# EasyEDA Pro project ProPrj_FPC屏幕排线及测试板.epro

# Schematic Schematic2_2
Board Name: MIPI转接板（含iic）; Create Date: 2025-09-10; Page Name: MIPI; Project Name: 3寸屏幕转接板; Schematic Name: Schematic2_2; Update Date: 2025-09-10; Company: 嘉立创EDA; Page Size: A4; Version: V1.0
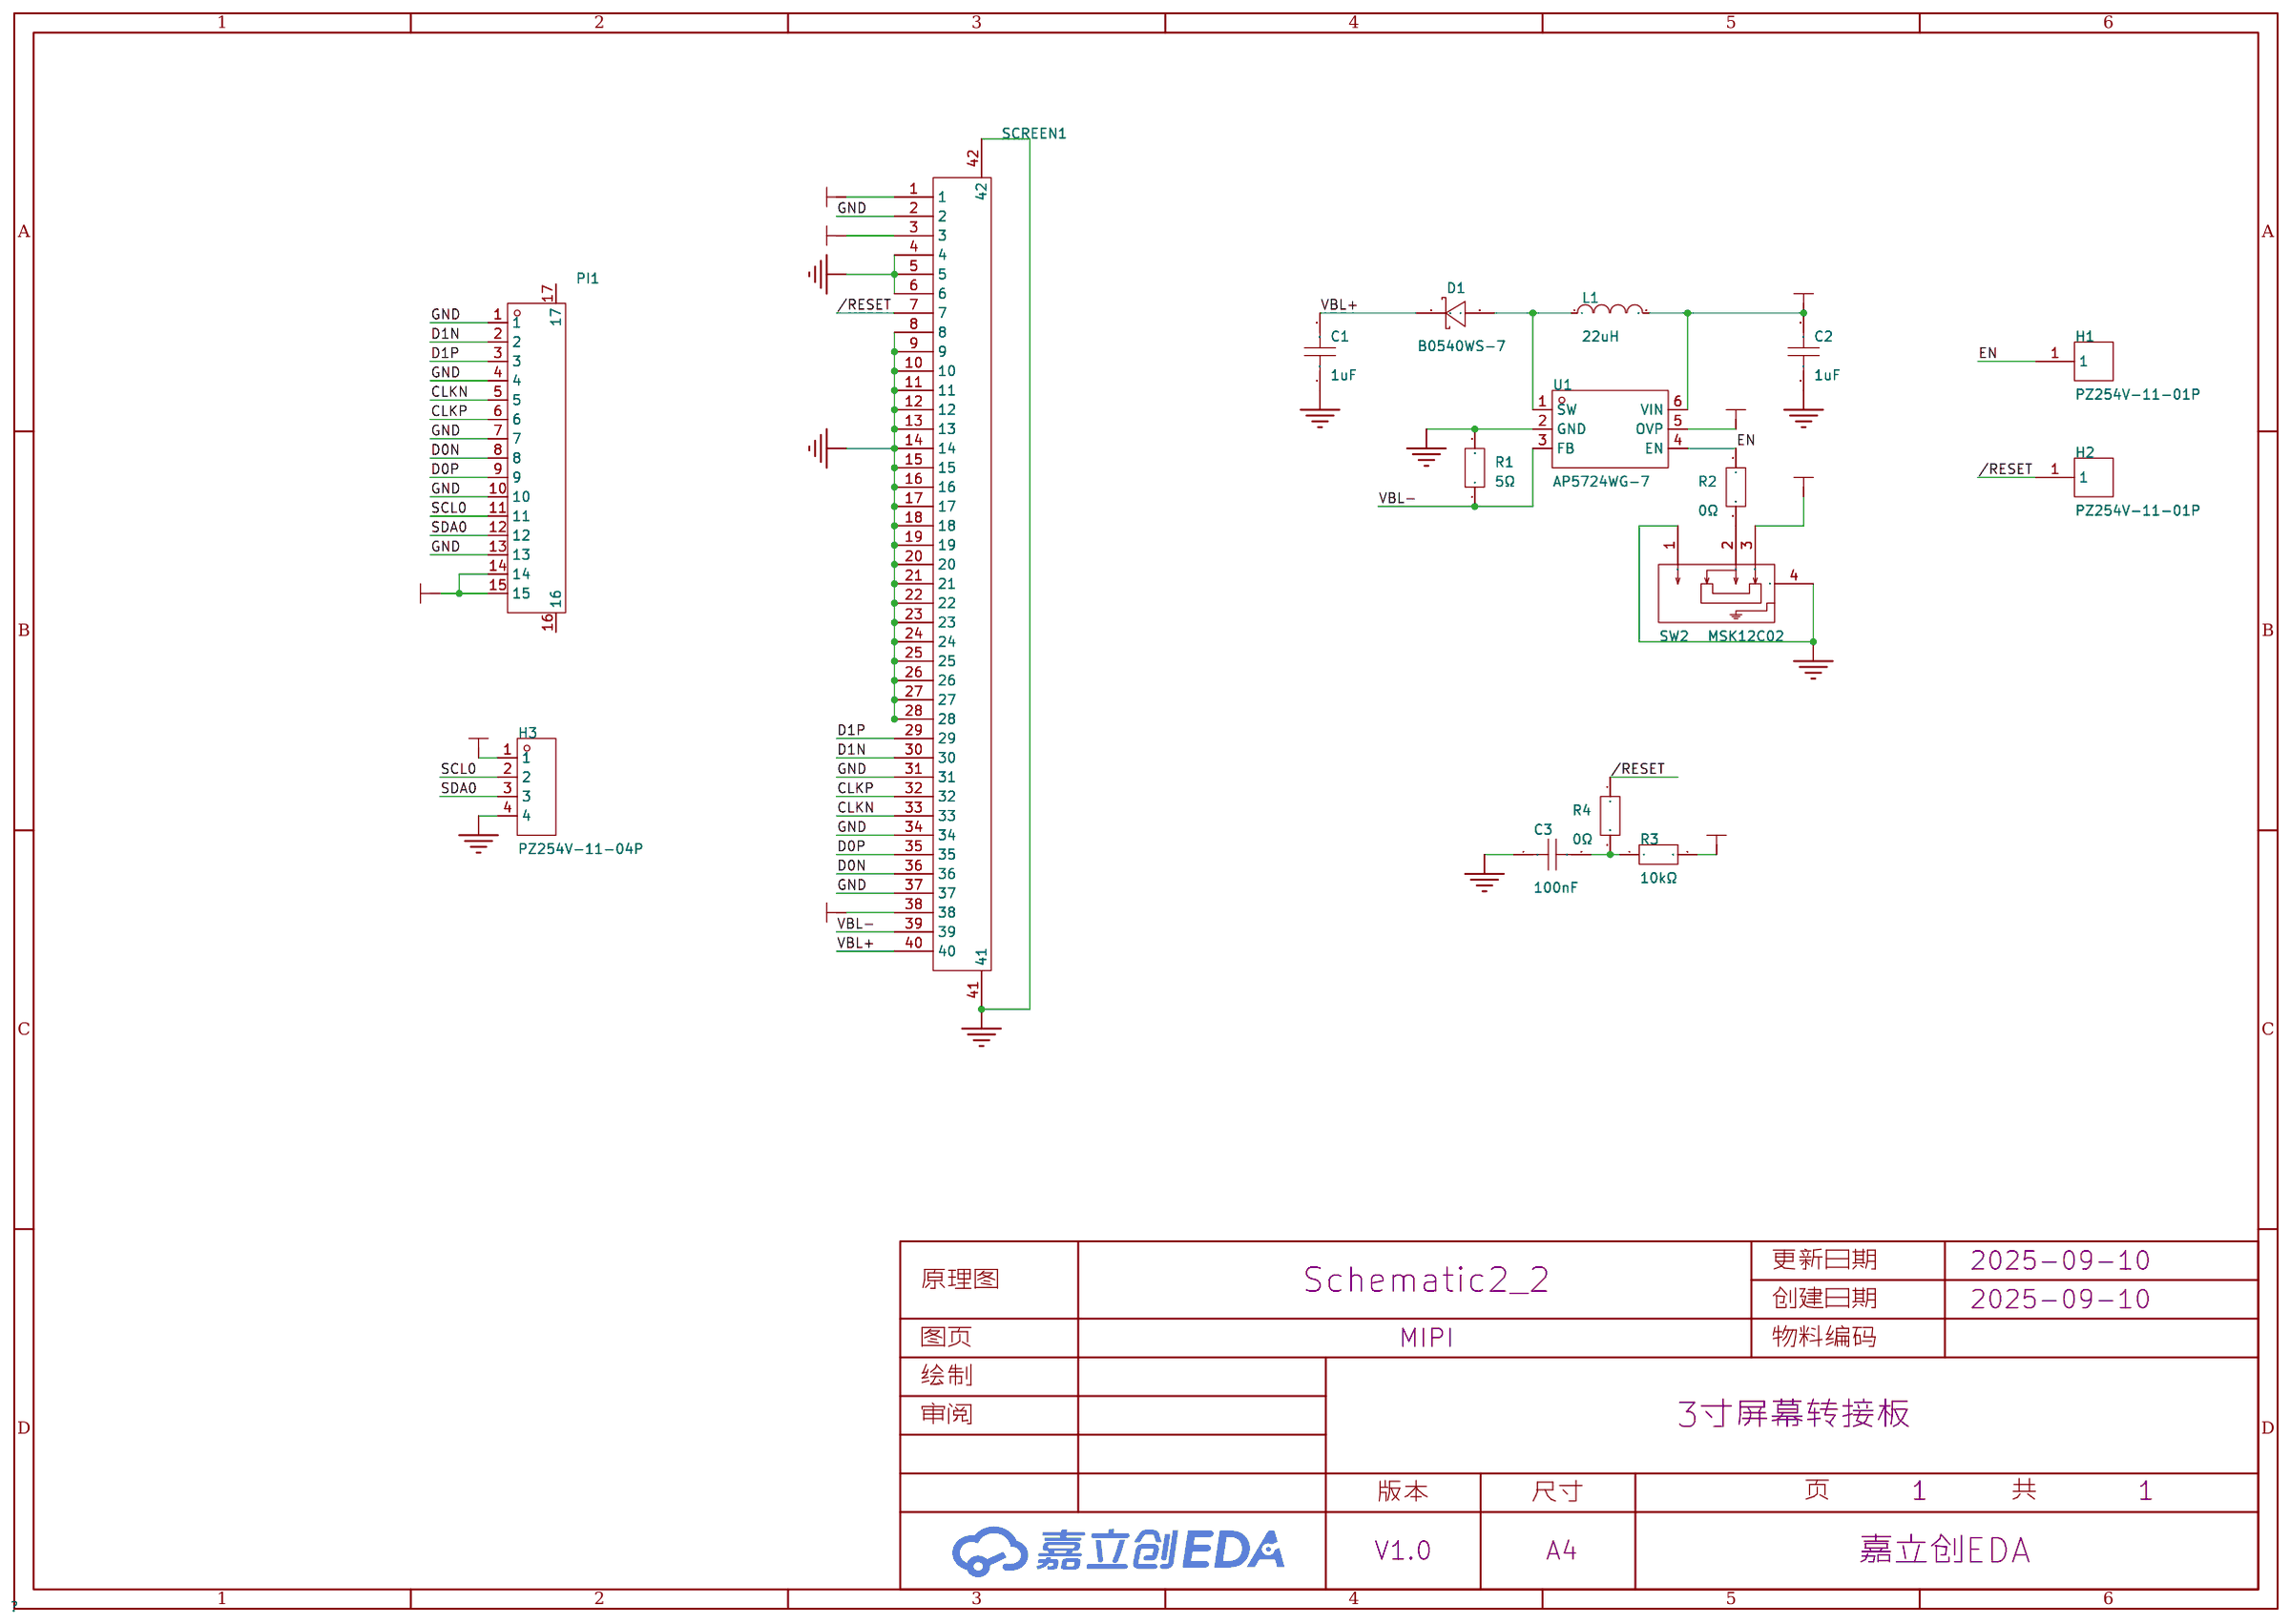
[diagram p0: schematic sheet]

## Parts
C1  1uF  [C0603]
C2  1uF  [C0603]
C3  100nF  [C0603]
D1  B0540WS-7  [SOD-323_L1.8-W1.3-LS2.5-RD]
H1  PZ254V-11-01P  [HDR-TH_1P-P2.54-V-M]
H2  PZ254V-11-01P  [HDR-TH_1P-P2.54-V-M]
H3  PZ254V-11-04P  [HDR-TH_4P-P2.54-V-M]
L1  22uH  [IND-SMD_L4.0-W4.0]
PI1  FPC-1.0FX-15PWCR-H20  [FPC-SMD_15P-P1.00_XUNPU_FPC-1.0FX-15PWCR-H20]
R1  5Ω  [R0603]
R2  0Ω  [R0603]
R3  10kΩ  [R0603]
R4  0Ω  [R0603]
SCREEN1  AFC01-S40FCA-00  [FPC-SMD_P0.50-40P_FGS-XJ-H2.0]
SW2  MSK12C02  [SW-TH_MSK12C02]
U1  AP5724WG-7  [SOT-23-6_L2.9-W1.6-P0.95-LS2.8-BL]

## Library data of the parts
C1-C3 = CC0603KRX7R9BB105: 容值:1uF;精度:±10%;额定电压:50V;材质(温度系数):X7R;; LCSC Part Name: 1uF ±10% 50V; Supplier Part: C559769; Manufacturer: YAGEO(国巨); Supplier Footprint: 0603; JLCPCB Part Class: 扩展库; Datasheet: https://atta.szlcsc.com/upload/public/pdf/source/20181031/C325451_C7CF01155AE3010E0D610C52F5FE7D31.pdf; Supplier: LCSC; Tolerance: ±10%; Voltage Rated: 50V; Temperature Coefficient: X7R
D1 = B0540WS-7: 正向压降(Vf):550mV@500mA;直流反向耐压(Vr):40V;整流电流:500mA;; LCSC Part Name: 电压:40V 电流:500mA; Supplier Part: C98664; Manufacturer: DIODES(美台); Supplier Footprint: SOD-323; JLCPCB Part Class: 扩展库; Datasheet: https://atta.szlcsc.com/upload/public/pdf/source/20171221/C98664_15138313338551195621.pdf; Supplier: LCSC; Forward Voltage (Vf@If): 550mV@500mA; Reverse Voltage (Vr): 40V; Rectified Current: 500mA; Reverse Leakage Current (Ir): 5uA@30V
H1 H2 = PZ254V-11-01P: 插针结构:1x1P;间距:2.54mm;行距:-;圆针/方针:方针;安装方式:直插;排数:单排;总PIN位数:1P;额定电流:-;额定电压:-;配合针长度:6mm;塑高:2.5mm;端接针长度:3mm;触头材质:黄铜;触头镀层:-;工作温度:-40℃~+105℃;颜色:黑色;; LCSC Part Name: 1x1P 间距:2.54mm 方针 直插; Supplier Part: C492400; Manufacturer: XFCN(兴飞); Supplier Footprint: 插件,P=2.54mm; JLCPCB Part Class: 扩展库; Datasheet: https://atta.szlcsc.com/upload/public/pdf/source/20200309/C492400_46876A5B545F5AE6B8D4A09C46E276E8.pdf; Supplier: LCSC; Pin Structure: 1x1P; Pitch: 2.54mm; Circluar Pins/Square Pins: 方针; Mounting Type: 直插; Number of Rows: 单排; Number of Pins: 1P; Length of Mating Pin: 6mm; Insulation Height: 2.5mm; Length of End Connection Pin: 3mm; Contact Material: 黄铜; Operating Temperature: -40℃~+105℃; Color: 黑色
H3 = PZ254V-11-04P: 插针结构:1x4P;间距:2.54mm;行距:-;圆针/方针:方针;安装类型:直插;排数:单排;总PIN位数:4P;额定电流:3A;额定电压:250V;配合针长度:6mm;塑高:2.5mm;端接针长度:3mm;触头材质:-;工作温度范围:-40℃~+105℃;颜色:黑色;; LCSC Part Name: 间距:2.54mm 1x4P 直插 方针; Supplier Part: C2691448; Manufacturer: XFCN(兴飞); Supplier Footprint: 插件,P=2.54mm; JLCPCB Part Class: 扩展库; Datasheet: https://atta.szlcsc.com/upload/public/pdf/source/20200309/C492403_F9F19131791D08044AD4F84F8E751A34.pdf; Supplier: LCSC; Pin Structure: 1x4P; Pitch: 2.54mm; Circluar Pins/Square Pins: 方针; Mounting Type: 直插; Number of Rows: 单排; Number of Pins: 4P; Current Rating (Max): 3A; Voltage Rating (Max): 250V; Length of Mating Pin: 6mm; Insulation Height: 2.5mm; Length of End Connection Pin: 3mm; Operating Temperature Range: -40℃~+105℃; Color: 黑色
L1 = SLS3D16S220MTT: 电感值:22uH;精度:±20%;额定电流:310mA;; LCSC Part Name: 22uH ±20%; Supplier Part: C364105; Manufacturer: Sunltech(顺磁); Supplier Footprint: SMD,4x4mm; JLCPCB Part Class: 扩展库; Datasheet: https://atta.szlcsc.com/upload/public/pdf/source/20190129/C364139_5B32995B150CB1C3097D10AB7A086957.pdf; Supplier: LCSC; Tolerance: ±20%; Current Rating: 310mA; DC Resistance(DCR): 356mΩ
PI1 = FPC-1.0FX-15PWCR-H20: 锁定特性:翻盖式;触点类型:下接;触点数量:15P;间距:1mm;安装类型:卧贴;; LCSC Part Name: 间距:1mm P数:15P 翻盖式 下接; Supplier Part: C19269358; Manufacturer: XUNPU(讯普); Supplier Footprint: SMD,P=1mm,卧贴; JLCPCB Part Class: 扩展库; Datasheet: https://atta.szlcsc.com/upload/public/pdf/source/20231121/46D1D420E162B395A0FFF09C3BB98E72.pdf; Supplier: LCSC; Locking Feature: 翻盖式; Contact Type: 下接; Number of Contacts: 15P; Pitch: 1mm; Mounting Type: 卧贴; Height Above Board: 2mm
R1-R4 = CSRT0603FT5R00: 电阻类型:薄膜电阻;阻值:5Ω;精度:±1%;功率:400mW;温度系数:±50ppm/℃;; LCSC Part Name: 薄膜电阻 5Ω ±1% 400mW; Supplier Part: C6145550; Manufacturer: SEI(Stackpole Electronics Inc.); Supplier Footprint: 0603; JLCPCB Part Class: 扩展库; Datasheet: https://atta.szlcsc.com/upload/public/pdf/source/231023/sei-csrt.pdf-64f9fffa9e691e2aa43dba71297e1c22.pdf; Supplier: LCSC; Type: 薄膜电阻; Tolerance: ±1%; Power(Watts): 400mW; Temperature Coefficient: ±50ppm/℃; Operating Temperature Range: -55℃~+155℃
SCREEN1 = AFC01-S40FCA-00: 锁定特性:翻盖式;触点类型:下接;触点数量:40P;间距:0.5mm;安装类型:卧贴;; LCSC Part Name: 间距:0.5mm P数:40P 翻盖式 下接; Supplier Part: C262674; Manufacturer: JS(钜硕电子); Supplier Footprint: SMD,P=0.5mm,卧贴; JLCPCB Part Class: 扩展库; Datasheet: https://atta.szlcsc.com/upload/public/pdf/source/20190816/C413942_2A72D1AC756EAE17EEDF756A339D4500.pdf; Supplier: LCSC; Locking Feature: 翻盖式; Contact Type: 下接; Number of Contacts: 40P; Pitch: 0.5mm; Mounting Type: 卧贴; FFC, FCB Thickness: 0.3mm; Height Above Board: 2mm
SW2 = MSK12C02: 电路结构:单刀双掷;安装方式:卧贴;开关颜色:-;额定电流(DC):50mA;额定电压(DC):12V;额定电流(AC):-;额定电压(AC):-;机械寿命:1万次;; LCSC Part Name: 两档侧拨贴片 7脚 滑动开关; Supplier Part: C431540; Manufacturer: SHOU HAN(首韩); Supplier Footprint: SMD; JLCPCB Part Class: 扩展库; Datasheet: https://atta.szlcsc.com/upload/public/pdf/source/20190925/C431540_89155AEF0758B9AD1B2D805F83FB12E3.pdf; Supplier: LCSC; Circuit: 单刀双掷; Pin Style: SMD接片; Switch Length: 8mm; Switch Width: 2.8mm; Switch Height: 1.4mm; Mounting Style: 卧贴; Current Rating (DC): 50mA; Voltage Rating (DC): 12V; Mechanical Life: 1万次; Operating Temperature: -20℃~+70℃
U1 = AP5724WG-7: 类型:DC-DC稳压器;工作电压:2.7V~5.5V;开关频率:1.2MHz;通道数:1;输出电压:-;输出电流:750mA;调光:PWM;拓扑结构:升压;; LCSC Part Name: 输出750mA 升压型驱动; Supplier Part: C154870; Manufacturer: DIODES(美台); Supplier Footprint: SOT-26; JLCPCB Part Class: 扩展库; Datasheet: https://atta.szlcsc.com/upload/public/pdf/source/20171221/C154870_15138395483881195892.pdf; Supplier: LCSC; Type: DC-DC稳压器; Voltage - Input: 2.7V~5.5V; Frequency - Switching: 1.2MHz; Number of Channels: 1; Output Current: 750mA; Dimming: PWM; Topology: 升压; Operating temperature: -40℃~+85℃

## Nets
3.3V: C2.2 H3.1 L1.2 PI1.14 PI1.15 R3.2 SCREEN1.1 SCREEN1.3 SCREEN1.38 SW2.3 U1.6(VIN)
GND: C1.1 C2.1 C3.1 H3.4 PI1.1 PI1.4 PI1.7 PI1.10 PI1.13 R1.2 SCREEN1.2 SCREEN1.4 SCREEN1.5 SCREEN1.6 SCREEN1.8 SCREEN1.9 SCREEN1.10 SCREEN1.11 SCREEN1.12 SCREEN1.13 SCREEN1.14 SCREEN1.15 SCREEN1.16 SCREEN1.17 SCREEN1.18 SCREEN1.19 SCREEN1.20 SCREEN1.21 SCREEN1.22 SCREEN1.23 SCREEN1.24 SCREEN1.25 SCREEN1.26 SCREEN1.27 SCREEN1.28 SCREEN1.31 SCREEN1.34 SCREEN1.37 SCREEN1.41 SCREEN1.42 SW2.1 SW2.4 U1.2(GND)
/RESET: H2.1 R4.1 SCREEN1.7
CLKN: PI1.5 SCREEN1.33
CLKP: PI1.6 SCREEN1.32
D0N: PI1.8 SCREEN1.36
D0P: PI1.9 SCREEN1.35
D1N: PI1.2 SCREEN1.30
D1P: PI1.3 SCREEN1.29
EN: H1.1 R2.1 U1.4(EN)
SCL0: H3.2 PI1.11
SDA0: H3.3 PI1.12
VBL+: C1.2 D1.1(C) SCREEN1.40 U1.5(OVP)
VBL-: R1.1 SCREEN1.39 U1.3(FB)
$1N1782: D1.2(A) L1.1 U1.1(SW)
$1N2676: R2.2 SW2.2
$1N2940: C3.2 R3.1 R4.2

Not connected (* = marked no-connect by the designer): PI1 16 17

# Schematic Schematic3
Board Name: 【复刻】FPC软排线; Create Date: 2025-09-10; Page Name: P1; Project Name: 3寸屏幕转接板; Schematic Name: Schematic3; Update Date: 2025-09-10; Company: 嘉立创EDA; Page Size: A4; Version: V1.0
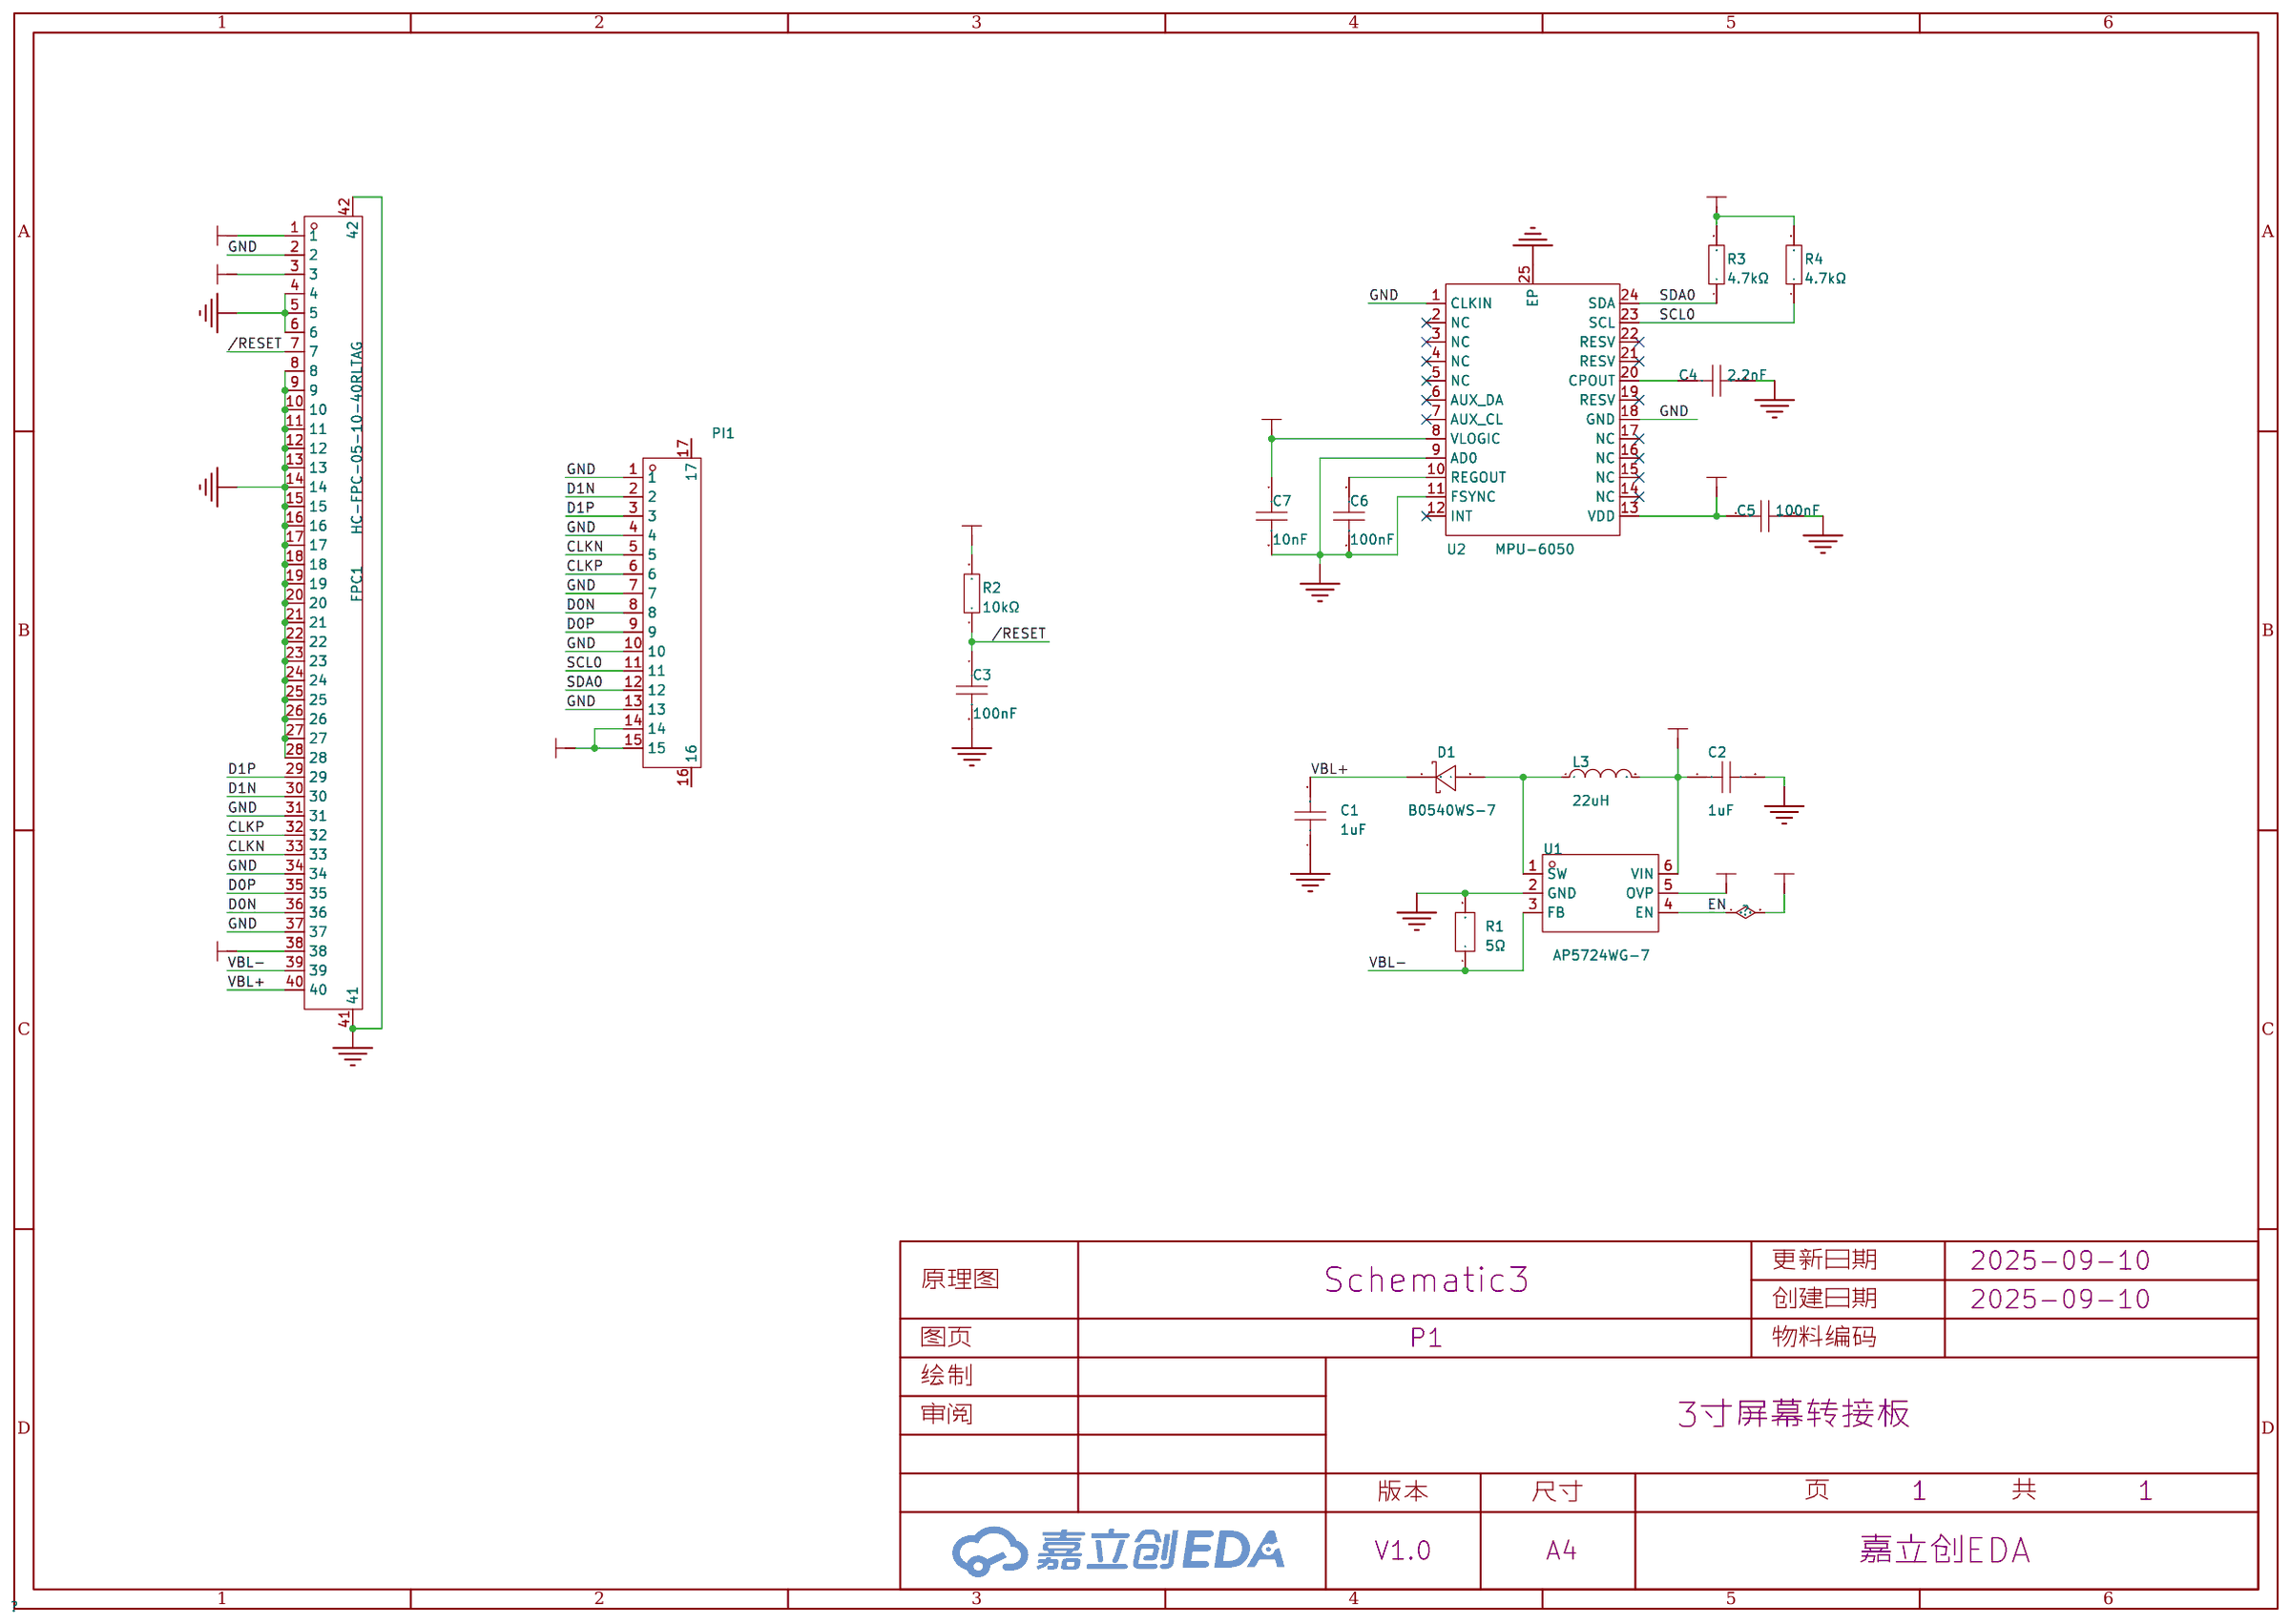
[diagram p1: schematic sheet]

## Parts
C1  1uF  [C0402]
C2  1uF  [C0402]
C3  100nF  [C0402]
C4  2.2nF  [C0603]
C5  100nF  [C0402]
C6  100nF  [C0402]
C7  10nF  [C0402]
D1  B0540WS-7  [SOD-323_L1.8-W1.3-LS2.5-RD]
FPC1  HC-FPC-05-10-40RLTAG  [FPC-SMD_40P-P0.50_HCTL_HC-FPC-05-10-40RLTAG]
L3  22uH  [IND-SMD_L2.5-W2.0_MHCHL2520]
PI1  FPC-1.0FX-15PWCR-H20  [FPC-SMD_15P-P1.00_XUNPU_FPC-1.0FX-15PWCR-H20]
R1  5Ω  [R0603]
R2  10kΩ  [R0402]
R3  4.7kΩ  [R0402]
R4  4.7kΩ  [R0402]
U1  AP5724WG-7  [SOT-23-6_L2.9-W1.6-P0.95-LS2.8-BL]
U2  MPU-6050  [QFN-24_L4.0-W4.0-P0.50-BL-EP2.7]

## Library data of the parts
C1 C2 = CL05A105KA5NQNC: 容值:1uF;精度:±10%;额定电压:25V;温度系数:X5R;; LCSC Part Name: 1uF ±10% 25V; Supplier Part: C52923; Manufacturer: SAMSUNG(三星); Supplier Footprint: 0402; JLCPCB Part Class: 基础库; Datasheet: https://item.szlcsc.com/datasheet/CL05A105KA5NQNC/53938.html; Supplier: LCSC; Tolerance: ±10%; Voltage Rating: 25V; Temperature Coefficient: X5R
C3 C5-C7 = GRM1555C1H222GA01D: 容值:2.2nF;精度:±2%;额定电压:50V;温度系数:C0G;; LCSC Part Name: 2.2nF ±2% 50V; Supplier Part: C2987940; Manufacturer: muRata(村田); Supplier Footprint: 0402; JLCPCB Part Class: 扩展库; Datasheet: https://item.szlcsc.com/datasheet/GRM1555C1H222GA01D/3443038.html; Supplier: LCSC; Tolerance: ±2%; Voltage Rating: 50V; Temperature Coefficient: C0G
C4 = CC0603KRX7R9BB105: 容值:1uF;精度:±10%;额定电压:50V;材质(温度系数):X7R;; LCSC Part Name: 1uF ±10% 50V; Supplier Part: C559769; Manufacturer: YAGEO(国巨); Supplier Footprint: 0603; JLCPCB Part Class: 扩展库; Datasheet: https://atta.szlcsc.com/upload/public/pdf/source/20181031/C325451_C7CF01155AE3010E0D610C52F5FE7D31.pdf; Supplier: LCSC; Tolerance: ±10%; Voltage Rated: 50V; Temperature Coefficient: X7R
D1 = B0540WS-7: 正向压降(Vf):550mV@500mA;直流反向耐压(Vr):40V;整流电流:500mA;; LCSC Part Name: 电压:40V 电流:500mA; Supplier Part: C98664; Manufacturer: DIODES(美台); Supplier Footprint: SOD-323; JLCPCB Part Class: 扩展库; Datasheet: https://atta.szlcsc.com/upload/public/pdf/source/20171221/C98664_15138313338551195621.pdf; Supplier: LCSC; Forward Voltage (Vf@If): 550mV@500mA; Reverse Voltage (Vr): 40V; Rectified Current: 500mA; Reverse Leakage Current (Ir): 5uA@30V
FPC1 = HC-FPC-05-10-40RLTAG: 锁定特性:翻盖式;触点类型:下接;触点数量:40P;间距:0.5mm;安装类型:卧贴;工作温度范围:-55℃~+85℃;; LCSC Part Name: 翻盖式 下接 P数:40P 间距:0.5mm; Supplier Part: C5213744; Manufacturer: HCTL(华灿天禄); Supplier Footprint: SMD,P=0.5mm,卧贴; JLCPCB Part Class: 扩展库; Datasheet: https://atta.szlcsc.com/upload/public/pdf/source/20221027/B2DE489DA152049D1F105170189CFB4E.pdf; Supplier: LCSC; Locking Feature: 翻盖式; Contact Type: 下接; Number of Contacts: 40P; Pitch: 0.5mm; Mounting Type: 卧贴; FFC, FCB Thickness: 0.3mm; Height Above Board: 1mm; Contact Material: 铜合金; Operating Temperature Range: -55℃~+85℃
L3 = FTC252010S220MBCA: 电感值:22uH;精度:±20%;额定电流:850mA;饱和电流(Isat):1.1A;类型:一体成型电感;; LCSC Part Name: 22uH ±20% 1.1A; Supplier Part: C5832391; Manufacturer: cjiang(长江微电); Supplier Footprint: SMD,2x2.5mm; JLCPCB Part Class: 扩展库; Datasheet: https://atta.szlcsc.com/upload/public/pdf/source/20230602/8FFEDA9C0247A92A0D4B67554BFE4091.pdf; Supplier: LCSC; Tolerance: ±20%; Rated Current: 850mA; Saturation Current (Isat): 1.1A; DC Resistance (DCR): 1.1Ω; Type: 一体成型电感
PI1 = FPC-1.0FX-15PWCR-H20: 锁定特性:翻盖式;触点类型:下接;触点数量:15P;间距:1mm;安装类型:卧贴;; LCSC Part Name: 间距:1mm P数:15P 翻盖式 下接; Supplier Part: C19269358; Manufacturer: XUNPU(讯普); Supplier Footprint: SMD,P=1mm,卧贴; JLCPCB Part Class: 扩展库; Datasheet: https://atta.szlcsc.com/upload/public/pdf/source/20231121/46D1D420E162B395A0FFF09C3BB98E72.pdf; Supplier: LCSC; Locking Feature: 翻盖式; Contact Type: 下接; Number of Contacts: 15P; Pitch: 1mm; Mounting Type: 卧贴; Height Above Board: 2mm
R1 = CSRT0603FT5R00: 电阻类型:薄膜电阻;阻值:5Ω;精度:±1%;功率:400mW;温度系数:±50ppm/℃;; LCSC Part Name: 薄膜电阻 5Ω ±1% 400mW; Supplier Part: C6145550; Manufacturer: SEI(Stackpole Electronics Inc.); Supplier Footprint: 0603; JLCPCB Part Class: 扩展库; Datasheet: https://atta.szlcsc.com/upload/public/pdf/source/231023/sei-csrt.pdf-64f9fffa9e691e2aa43dba71297e1c22.pdf; Supplier: LCSC; Type: 薄膜电阻; Tolerance: ±1%; Power(Watts): 400mW; Temperature Coefficient: ±50ppm/℃; Operating Temperature Range: -55℃~+155℃
R2-R4 = 0402WGF4701TCE: 电阻类型:厚膜电阻;阻值:4.7kΩ;精度:±1%;功率:62.5mW;工作电压:50V;温度系数:±100ppm/℃;; LCSC Part Name: 4.7kΩ ±1% 62.5mW 厚膜电阻; Supplier Part: C25900; Manufacturer: UNI-ROYAL(厚声); Supplier Footprint: 0402; JLCPCB Part Class: 基础库; Datasheet: https://item.szlcsc.com/datasheet/0402WGF4701TCE/26643.html; Supplier: LCSC; Type: 厚膜电阻; Tolerance: ±1%; Power(Watts): 62.5mW; Voltage-Supply(Max): 50V; Temperature Coefficient: ±100ppm/℃; Operating Temperature: -55℃~+155℃
U1 = AP5724WG-7: 类型:DC-DC稳压器;工作电压:2.7V~5.5V;开关频率:1.2MHz;通道数:1;输出电压:-;输出电流:750mA;调光:PWM;拓扑结构:升压;; LCSC Part Name: 输出750mA 升压型驱动; Supplier Part: C154870; Manufacturer: DIODES(美台); Supplier Footprint: SOT-26; JLCPCB Part Class: 扩展库; Datasheet: https://atta.szlcsc.com/upload/public/pdf/source/20171221/C154870_15138395483881195892.pdf; Supplier: LCSC; Type: DC-DC稳压器; Voltage - Input: 2.7V~5.5V; Frequency - Switching: 1.2MHz; Number of Channels: 1; Output Current: 750mA; Dimming: PWM; Topology: 升压; Operating temperature: -40℃~+85℃
U2 = MPU-6050: 传感器类型:加速度计陀螺仪;; Supplier Part: C24112; Manufacturer: TDK InvenSense(应美盛); Supplier Footprint: QFN-24-EP(4x4); JLCPCB Part Class: 扩展库; Datasheet: https://item.szlcsc.com/datasheet/MPU-6050/24852.html; Supplier: LCSC; Sensor Type: 加速度计陀螺仪; Operating Temperature: -40℃~+85℃

## Nets
3.3V: C2.1 C5.1 C7.1 FPC1.1 FPC1.3 FPC1.38 L3.2 PI1.14 PI1.15 R2.2 R3.2 R4.2 U1.4(EN) U1.6(VIN) U2.8(VLOGIC) U2.13(VDD)
GND: C1.1 C2.2 C3.2 C4.1 C5.2 C6.2 C7.2 FPC1.2 FPC1.4 FPC1.5 FPC1.6 FPC1.8 FPC1.9 FPC1.10 FPC1.11 FPC1.12 FPC1.13 FPC1.14 FPC1.15 FPC1.16 FPC1.17 FPC1.18 FPC1.19 FPC1.20 FPC1.21 FPC1.22 FPC1.23 FPC1.24 FPC1.25 FPC1.26 FPC1.27 FPC1.28 FPC1.31 FPC1.34 FPC1.37 FPC1.41 FPC1.42 PI1.1 PI1.4 PI1.7 PI1.10 PI1.13 R1.2 U1.2(GND) U2.1(CLKIN) U2.9(AD0) U2.11(FSYNC) U2.18(GND) U2.25(EP)
/RESET: C3.1 FPC1.7 R2.1
CLKN: FPC1.33 PI1.5
CLKP: FPC1.32 PI1.6
D0N: FPC1.36 PI1.8
D0P: FPC1.35 PI1.9
D1N: FPC1.30 PI1.2
D1P: FPC1.29 PI1.3
SCL0: PI1.11 R4.1 U2.23(SCL)
SDA0: PI1.12 R3.1 U2.24(SDA)
VBL+: C1.2 D1.1(C) FPC1.40 U1.5(OVP)
VBL-: FPC1.39 R1.1 U1.3(FB)
$1N1059: D1.2(A) L3.1 U1.1(SW)
$1N1429: C4.2 U2.20(CPOUT)
$1N1625: C6.1 U2.10(REGOUT)

Not connected (* = marked no-connect by the designer): PI1 16 17; U2 2(NC)* 3(NC)* 4(NC)* 5(NC)* 6(AUX_DA)* 7(AUX_CL)* 12(INT)* 14(NC)* 15(NC)* 16(NC)* 17(NC)* 19(RESV)* 21(RESV)* 22(RESV)*

# Board PCB3_2
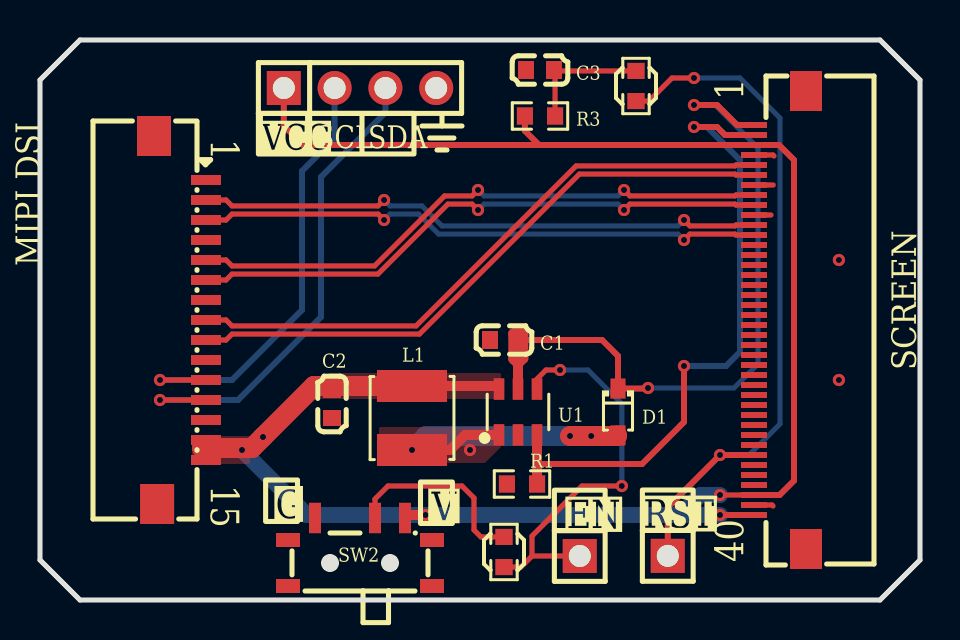
[diagram p2: board, top side]
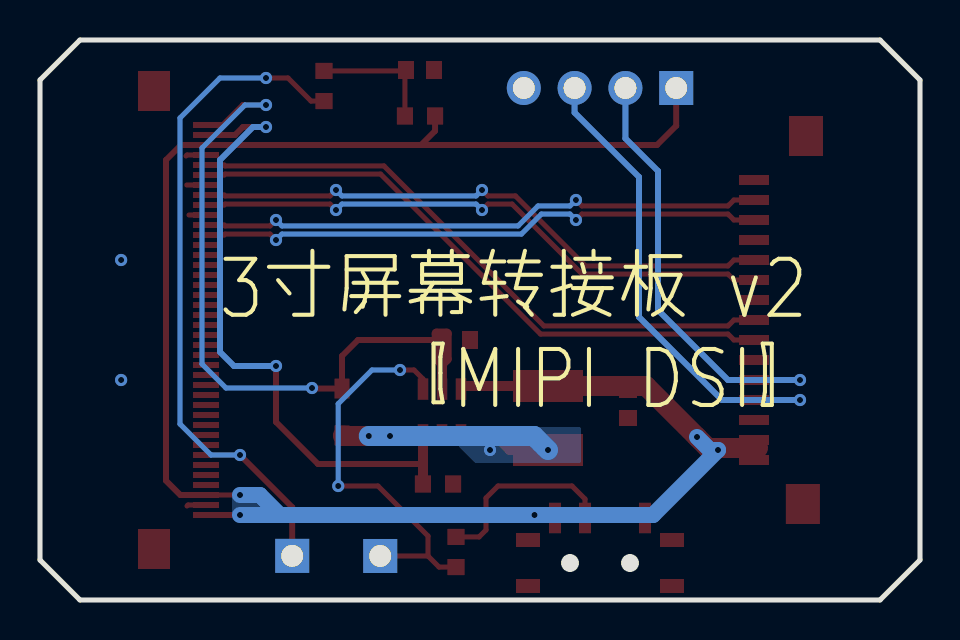
[diagram p3: board, bottom side, seen from below]

Outline 44 x 28 mm; copper layers: Top Layer, Bottom Layer. Coordinates in mm from the lower left corner of the outline.
Outline path: 0,26 0,2 2,0 42,0 44,2 44,26 42,28 2,28 0,26
Stack: Top Layer 0.035mm / Dielectric1 1.51mm FR4 er 4.5 / Bottom Layer 0.035mm

## Design rules (mm)
net D0P: D0
net D0N: D0
net CLKP: CLK
net CLKN: CLK
net D1P: D1
net D1N: D1
template: 自定义配置
spacing copperThickness1oz (default): track to track 0.102, other pairs 0.152 to 0.3
spacing copperThickness2oz: track to track 0.203, other pairs 0.152 to 0.3
track width copperThickness1oz (default): min 0.127, default 0.254, max 2.54
track width copperThickness2oz: min 0.203, default 0.254, max 2.54
differential pair differentialPair (default): width min 0.127, default 0.254, max 2.54; gap min 0.152, default 0.152
via viaSize (default): diameter min 0.5, default 0.61, max 10; hole min 0.3, default 0.305, max 6.3

## Placement (name value [footprint] x y rotation side)
C1  1uF  [C0603]  23.2 13 0 top
C2  1uF  [C0603]  14.6 9.8 90 top
C3  100nF  [C0603]  25 26.5 0 top
D1  B0540WS-7  [SOD-323_L1.8-W1.3-LS2.5-RD]  28.9 9.4 270 top
H1  PZ254V-11-01P  [HDR-TH_1P-P2.54-V-M]  26.99 2.2 90 top
H2  PZ254V-11-01P  [HDR-TH_1P-P2.54-V-M]  31.39 2.21 0 top
H3  PZ254V-11-04P  [HDR-TH_4P-P2.54-V-M]  16 25.6 0 top
L1  22uH  [IND-SMD_L4.0-W4.0]  18.6 9.1 90 top
MIPI DSI  FPC-1.0FX-15PWCR-H20  [FPC-SMD_15P-P1.00_XUNPU_FPC-1.0FX-15PWCR-H20]  7 14 270 top
R1  5Ω  [R0603]  24.1 5.8 180 top
R2  0Ω  [R0603]  23.2 2.4 90 top
R3  10kΩ  [R0603]  25 24.2 180 top
R4  0Ω  [R0603]  29.8 25.7 90 top
SCREEN  AFC01-S40FCA-00  [FPC-SMD_P0.50-40P_FGS-XJ-H2.0]  37 14 270 top
SW2  MSK12C02  [SW-TH_MSK12C02]  16 2.4 0 top
U1  AP5724WG-7  [SOT-23-6_L2.9-W1.6-P0.95-LS2.8-BL]  23.9 9.4 0 top

## Footprints (pads in the part's own frame, mm; a bottom-side part is the same pattern mirrored in y, then rotated)
C0603
  rect 0.8x0.9 smd: 1(-0.7,0) 2(0.7,0)
FPC-SMD_15P-P1.00_XUNPU_FPC-1.0FX-15PWCR-H20
  rect 0.5x1.5 smd: 1(-7,1.3) 2(-6,1.3) 3(-5,1.3) 4(-4,1.3) 5(-3,1.3) 6(-2,1.3) 7(-1,1.3) 8(0,1.3) 9(1,1.3) 10(2,1.3) 11(3,1.3) 12(4,1.3) 13(5,1.3) 14(6,1.3) 15(7,1.3)
  rect 2x1.7 smd: 16(9.2,-1.143) 17(-9.2,-1.3)
FPC-SMD_P0.50-40P_FGS-XJ-H2.0
  rect 0.3x1.3 smd: 1(9.75,-1.3) 2(9.25,-1.3) 3(8.75,-1.3) 4(8.25,-1.3) 5(7.75,-1.3) 6(7.25,-1.3) 7(6.75,-1.3) 8(6.25,-1.3) 9(5.75,-1.3) 10(5.25,-1.3) 11(4.75,-1.3) 12(4.25,-1.3) 13(3.75,-1.3) 14(3.25,-1.3) 15(2.75,-1.3) 16(2.25,-1.3) 17(1.75,-1.3) 18(1.25,-1.3) 19(0.75,-1.3) 20(0.25,-1.3) 21(-0.25,-1.3) 22(-0.75,-1.3) 23(-1.25,-1.3) 24(-1.75,-1.3) 25(-2.25,-1.3) 26(-2.75,-1.3) 27(-3.25,-1.3) 28(-3.75,-1.3) 29(-4.25,-1.3) 30(-4.75,-1.3) 31(-5.25,-1.3) 32(-5.75,-1.3) 33(-6.25,-1.3) 34(-6.75,-1.3) 35(-7.25,-1.3) 36(-7.75,-1.3) 37(-8.25,-1.3) 38(-8.75,-1.3) 39(-9.25,-1.3) 40(-9.75,-1.3)
  rect 2x1.6 smd: 41(-11.45,1.3) 42(11.45,1.3)
HDR-TH_1P-P2.54-V-M
  rect 1.7x1.7 hole 1.1: 1(0,0)
HDR-TH_4P-P2.54-V-M
  rect 1.7x1.7 hole 1.1: 1(-3.81,0)
  round 1.7 hole 1.1: 2(-1.27,0) 3(1.27,0) 4(3.81,0)
IND-SMD_L4.0-W4.0
  rect 1.6x3.5 smd: 1(-1.6,0) 2(1.6,0)
R0603
  rect 0.806x0.864 smd: 1(-0.753,0) 2(0.753,0)
SOD-323_L1.8-W1.3-LS2.5-RD
  rect 1x0.75 smd: 1(-1.173,0) 2(1.173,0)
SOT-23-6_L2.9-W1.6-P0.95-LS2.8-BL
  rect 0.532x1.072 smd: 1(-0.95,-1.149) 2(0,-1.149) 3(0.95,-1.149) 4(0.95,1.149) 5(0,1.149) 6(-0.95,1.149)
SW-TH_MSK12C02
  rect 0.6x1.524 smd: 1(-2.25,1.7) 2(0.75,1.7) 3(2.25,1.7)
  rect 1.2x0.7 smd: 4(-3.6,0.6) 4(-3.6,-1.7) 4(3.6,0.6) 4(3.6,-1.7)

## Nets
3.3V: C2.2 H3.1 L1.2 MIPI DSI.14 MIPI DSI.15 R3.2 SCREEN.1 SCREEN.3 SCREEN.38 SW2.3 U1.6
GND: C1.1 C2.1 C3.1 H3.4 MIPI DSI.1 MIPI DSI.4 MIPI DSI.7 MIPI DSI.10 MIPI DSI.13 R1.2 SCREEN.2 SCREEN.4 SCREEN.5 SCREEN.6 SCREEN.8 SCREEN.9 SCREEN.10 SCREEN.11 SCREEN.12 SCREEN.13 SCREEN.14 SCREEN.15 SCREEN.16 SCREEN.17 SCREEN.18 SCREEN.19 SCREEN.20 SCREEN.21 SCREEN.22 SCREEN.23 SCREEN.24 SCREEN.25 SCREEN.26 SCREEN.27 SCREEN.28 SCREEN.31 SCREEN.34 SCREEN.37 SCREEN.41 SCREEN.42 SW2.1 SW2.4 U1.2
/RESET: H2.1 R4.1 SCREEN.7
CLKN: MIPI DSI.5 SCREEN.33
CLKP: MIPI DSI.6 SCREEN.32
D0N: MIPI DSI.8 SCREEN.36
D0P: MIPI DSI.9 SCREEN.35
D1N: MIPI DSI.2 SCREEN.30
D1P: MIPI DSI.3 SCREEN.29
EN: H1.1 R2.1 U1.4
SCL0: H3.2 MIPI DSI.11
SDA0: H3.3 MIPI DSI.12
VBL+: C1.2 D1.1 SCREEN.40 U1.5
VBL-: R1.1 SCREEN.39 U1.3
$1N1782: D1.2 L1.1 U1.1
$1N2676: R2.2 SW2.2
$1N2940: C3.2 R3.1 R4.2

Pads without a net: MIPI DSI 16 17

## Via types
v1: diameter 0.61, hole 0.305, Top Layer to Bottom Layer, 29 vias

## Routing (per net, layer and track width the routed paths; a pad name or vN(x,y) marks a point on that pad's centre or on a via; arc(x,y) is an arc through that point)
3.3V: length 97.8
  Top Layer w0.254: SCREEN.3 v1(34,5.25)
  Top Layer w0.3: SCREEN.1 v1(34,4.25) ; 24.95,22.75 24.25,23.45 R3.2 ; 24.95,22.75 13.15,22.75 12.19,23.71 H3.1 ; 24.95,22.75 SCREEN.38 36.95,22.75 37.7,22 37.7,5.97 36.98,5.25 SCREEN.3
  Top Layer w0.5: U1.6 22.8,10.7 L1.2 ; v1(19.28,4.25) 18.4,4.25 SW2.3
  Top Layer w1: L1.2 13.7,10.7 v1(11.15,8.15) 10.6,7.6 8.1,7.6
  Bottom Layer w0.8: 32.01,4.25 v1(34,4.25) ; 32.01,4.25 33.01,5.25 v1(34,5.25) ; 32.01,4.25 v1(19.28,4.25) 13.35,4.25 v1(10.1,7.5) 10.5,7.5 v1(11.15,8.15)
GND: length 3.8
  Top Layer w0.254: SCREEN.37 36.65,22.25 36.7,22.2 ; SCREEN.34 36.66,20.75 ; SCREEN.31 36.55,19.25 ; SCREEN.2 36.6,4.75 36.65,4.7
  vias: v1(39.94,17) v1(39.94,11)
/RESET: length 35.3
  Top Layer w0.254: v1(32.7,26.1) 31.6,26.1 30.45,24.95 R4.1
  Top Layer w0.3: H2.1 31.39,4.64 v1(34,7.25) SCREEN.7
  Bottom Layer w0.254: v1(34,7.25) 35.45,7.25 37,8.8 37,24.1 35,26.1 v1(32.7,26.1)
CLKN: length 29.5
  Top Layer w0.254: SCREEN.33 34.8,20.25 34.75,20.2 29.5,20.2 v1(29.2,20.5) ; MIPI DSI.5 9.3,17 9.6,16.7 16.73,16.7 20.23,20.2 21.6,20.2 v1(21.9,20.5)
  Bottom Layer w0.254: v1(21.9,20.5) 22.2,20.2 28.9,20.2 v1(29.2,20.5)
CLKP: length 29.5
  Top Layer w0.254: MIPI DSI.6 9.3,16 9.6,16.3 16.9,16.3 20.4,19.8 21.6,19.8 v1(21.9,19.5) ; v1(29.2,19.5) 29.5,19.8 34.75,19.8 34.8,19.75 SCREEN.32
  Bottom Layer w0.254: v1(21.9,19.5) 22.2,19.8 28.9,19.8 v1(29.2,19.5)
D0N: length 30.9
  Top Layer w0.254: SCREEN.36 34.8,21.75 34.75,21.7 26.8,21.7 18.8,13.7 9.6,13.7 9.3,14 MIPI DSI.8
D0P: length 30.9
  Top Layer w0.254: MIPI DSI.9 9.3,13 9.6,13.3 18.97,13.3 26.97,21.3 34.75,21.3 34.8,21.25 SCREEN.35
D1N: length 28.4
  Top Layer w0.254: MIPI DSI.2 9.3,20 9.6,19.7 16.91,19.7 v1(17.2,20) ; SCREEN.30 34.8,18.75 34.75,18.7 32.5,18.7 v1(32.2,19)
  Bottom Layer w0.254: v1(32.2,19) 31.9,18.7 20.1,18.7 19.1,19.7 17.5,19.7 v1(17.2,20)
D1P: length 28.4
  Top Layer w0.254: SCREEN.29 34.8,18.25 34.75,18.3 32.5,18.3 v1(32.2,18) ; v1(17.2,19) 16.91,19.3 9.6,19.3 9.3,19 MIPI DSI.3
  Bottom Layer w0.254: v1(32.2,18) 31.9,18.3 19.93,18.3 18.93,19.3 17.5,19.3 v1(17.2,19)
EN: length 20.3
  Top Layer w0.254: v1(26,11.5) 25.3,11.5 24.85,11.05 U1.4 ; H1.1 24.6,2.2 ; 24.6,2.2 24.05,1.65 R2.1 ; 24.6,2.2 24.6,3.2 27.1,5.7 v1(29.09,5.7)
  Bottom Layer w0.254: v1(29.09,5.7) 29.09,9.81 27.4,11.5 v1(26,11.5)
SCL0: length 22.6
  Top Layer w0.254: MIPI DSI.11 v1(6,11)
  Bottom Layer w0.3: v1(6,11) 9.6,11 13.1,14.5 13.1,21.45 14.73,23.08 H3.2
SDA0: length 24.9
  Top Layer w0.254: MIPI DSI.12 v1(6,10)
  Bottom Layer w0.3: H3.3 17.27,24.37 14.05,21.15 14.05,14.15 9.9,10 v1(6,10)
VBL+: length 38.9
  Top Layer w0.3: C1.2 28.1,13 28.9,12.2 D1.1 30.37,10.57 v1(30.4,10.6) ; v1(32.7,24.75) 33.85,24.75 34.85,23.75 SCREEN.40
  Top Layer w0.5: C1.2 U1.5 ; 23.66,13.32 23.66,12.05 23.9,11.81 24.16,12.08 24.16,13.32 23.66,13.32
  Bottom Layer w0.254: v1(30.4,10.6) 34.7,10.6 35.9,11.8 35.9,22.6 33.75,24.75 v1(32.7,24.75)
VBL-: length 32.4
  Top Layer w0.3: SCREEN.39 34.25,23.25 33.85,23.65 v1(32.7,23.65) ; v1(32.2,11.7) 32.2,8.9 30.1,6.8 25,6.8 24.85,6.65
  Top Layer w0.5: R1.1 24.85,5.8 U1.3
  Bottom Layer w0.3: v1(32.7,23.65) 33.35,23.65 35,22 35,12.4 34.3,11.7 v1(32.2,11.7)
$1N1782: length 16.3
  Top Layer w0.5: v1(18.6,7.5) 20.5,7.5 21.25,8.25 U1.1
  Top Layer w1: v1(26.5,8.2) v1(27.56,8.2) 28.83,8.2 28.85,8.22
  Bottom Layer w1: v1(27.56,8.2) v1(26.5,8.2) 19.3,8.2 v1(18.6,7.5)
  vias: v1(21.5,7.5)
$1N2676: length 10.1
  Top Layer w0.254: 16.75,3.7 16.75,5.05 17.4,5.7 21.1,5.7 21.7,5.1 21.7,3.5 22.05,3.15 R2.2
$1N2940: length 6
  Top Layer w0.254: 25.75,26.45 C3.2 ; 25.75,26.45 25.75,26.45 R3.1 ; 25.75,26.45 29.4,26.45

## Copper pours and planes (outline as drawn; the poured copper is in the pictures)
3.3V on Top Layer: 7.6,8.2 10.5,8.2 10.5,6.8 7.6,6.8
3.3V on Top Layer: 23.2,9.9 23.2,11.5 14.4,11.5 13.9,11 13.9,9.9
3.3V on Bottom Layer: 32.78,5.25 34.4,5.25 34.4,4.25 32.78,4.25
GND on Top Layer: -2.6,30.4 52.8,30.4 52.8,-7.8 -2.6,-7.8
GND on Bottom Layer: -6.5,34.4 46.5,34.4 46.5,-3.6 -6.5,-3.6
$1N1782 on Top Layer: 16.8,6.7 16.8,8.8 23.2,8.8 23.2,7.6 22.3,6.7
$1N1782 on Bottom Layer: 16.8,6.7 16.8,8.8 23.2,8.8 23.2,7.6 22.3,6.7

## Text on the board
Bottom Silkscreen Layer: 3寸屏幕转接板 v2 / 【MIPI DSI】
Top Silkscreen Layer: SCL | SDA | VCC | G | V | EN | RST | 1 | 40 | 15

# Board PCB9
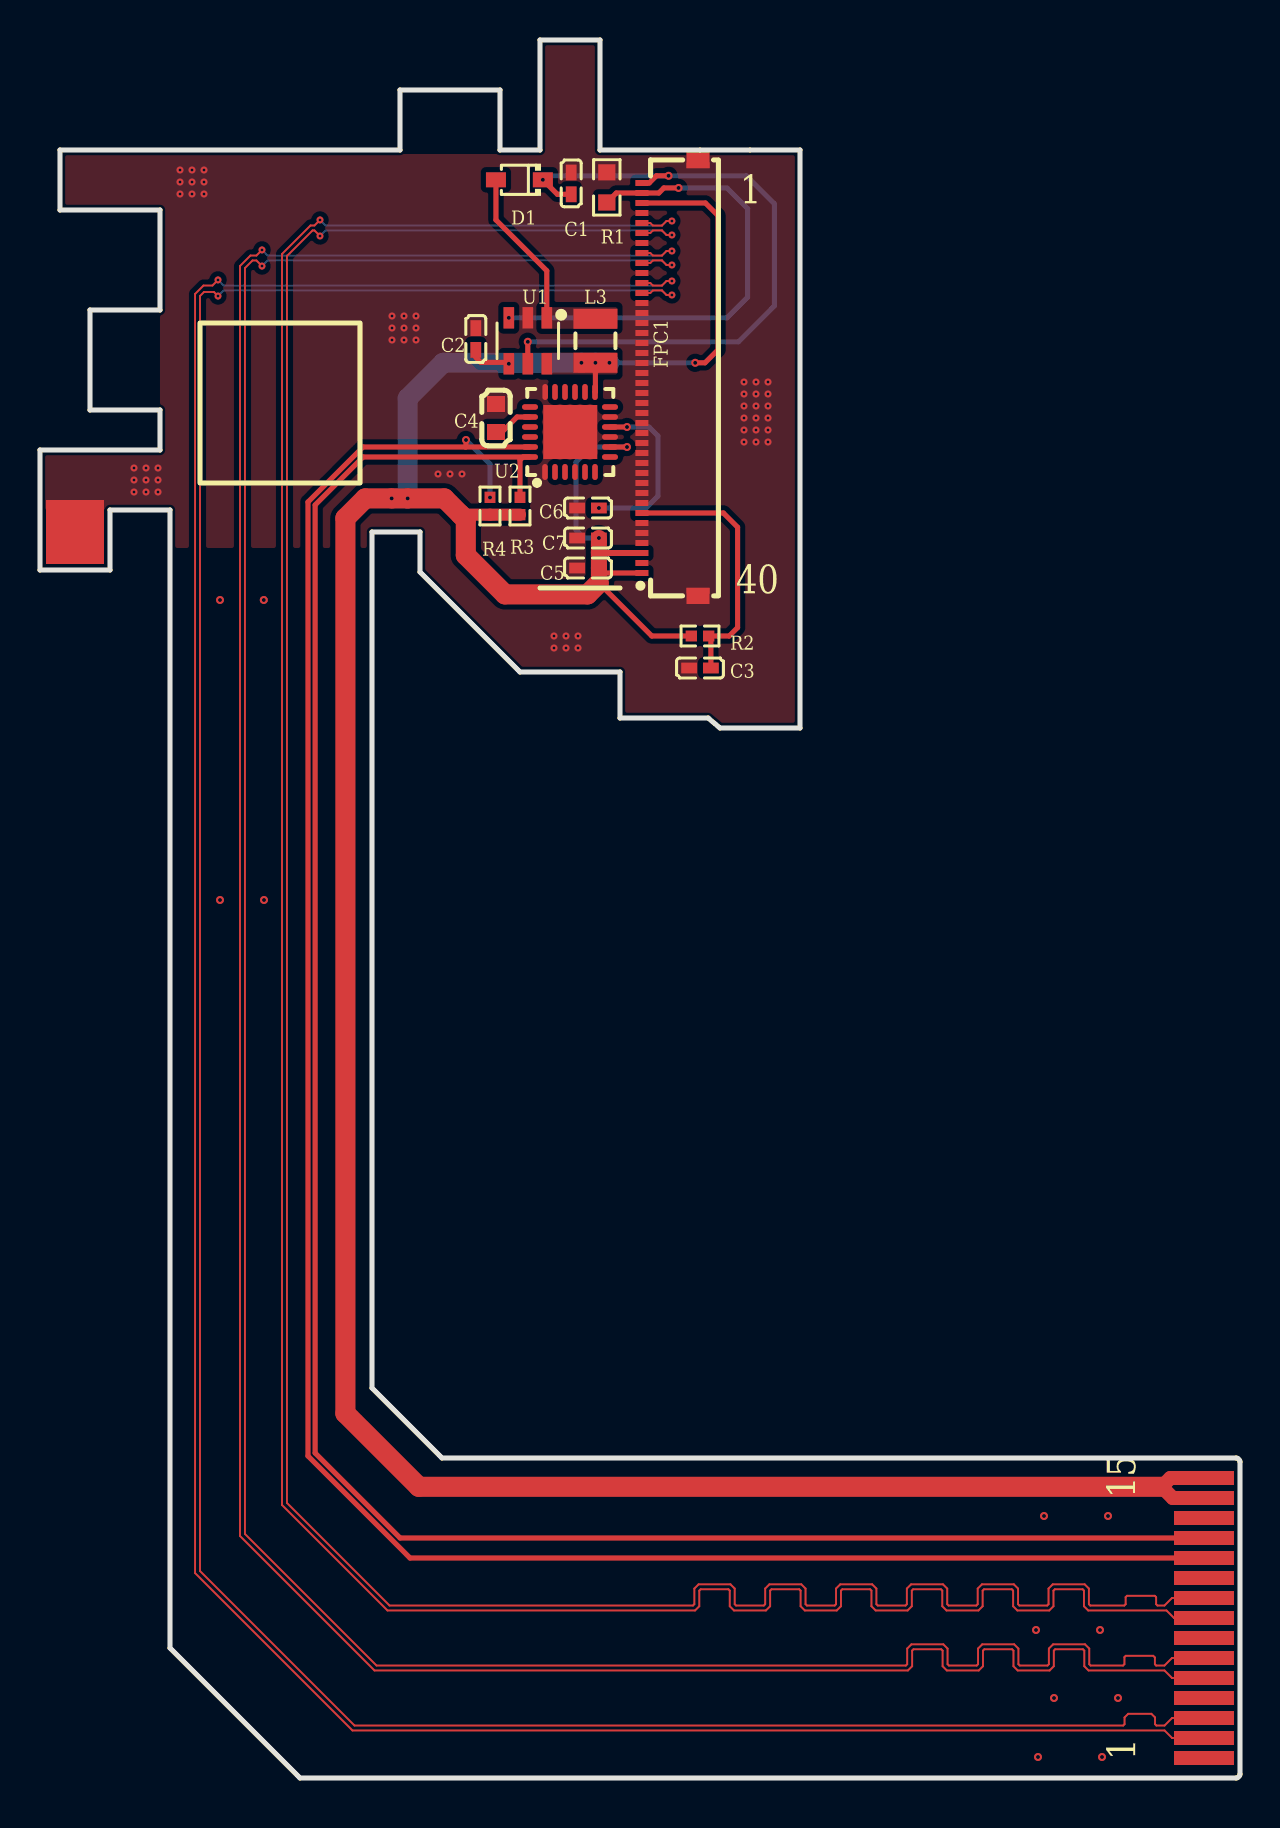
[diagram p4: board, top side]
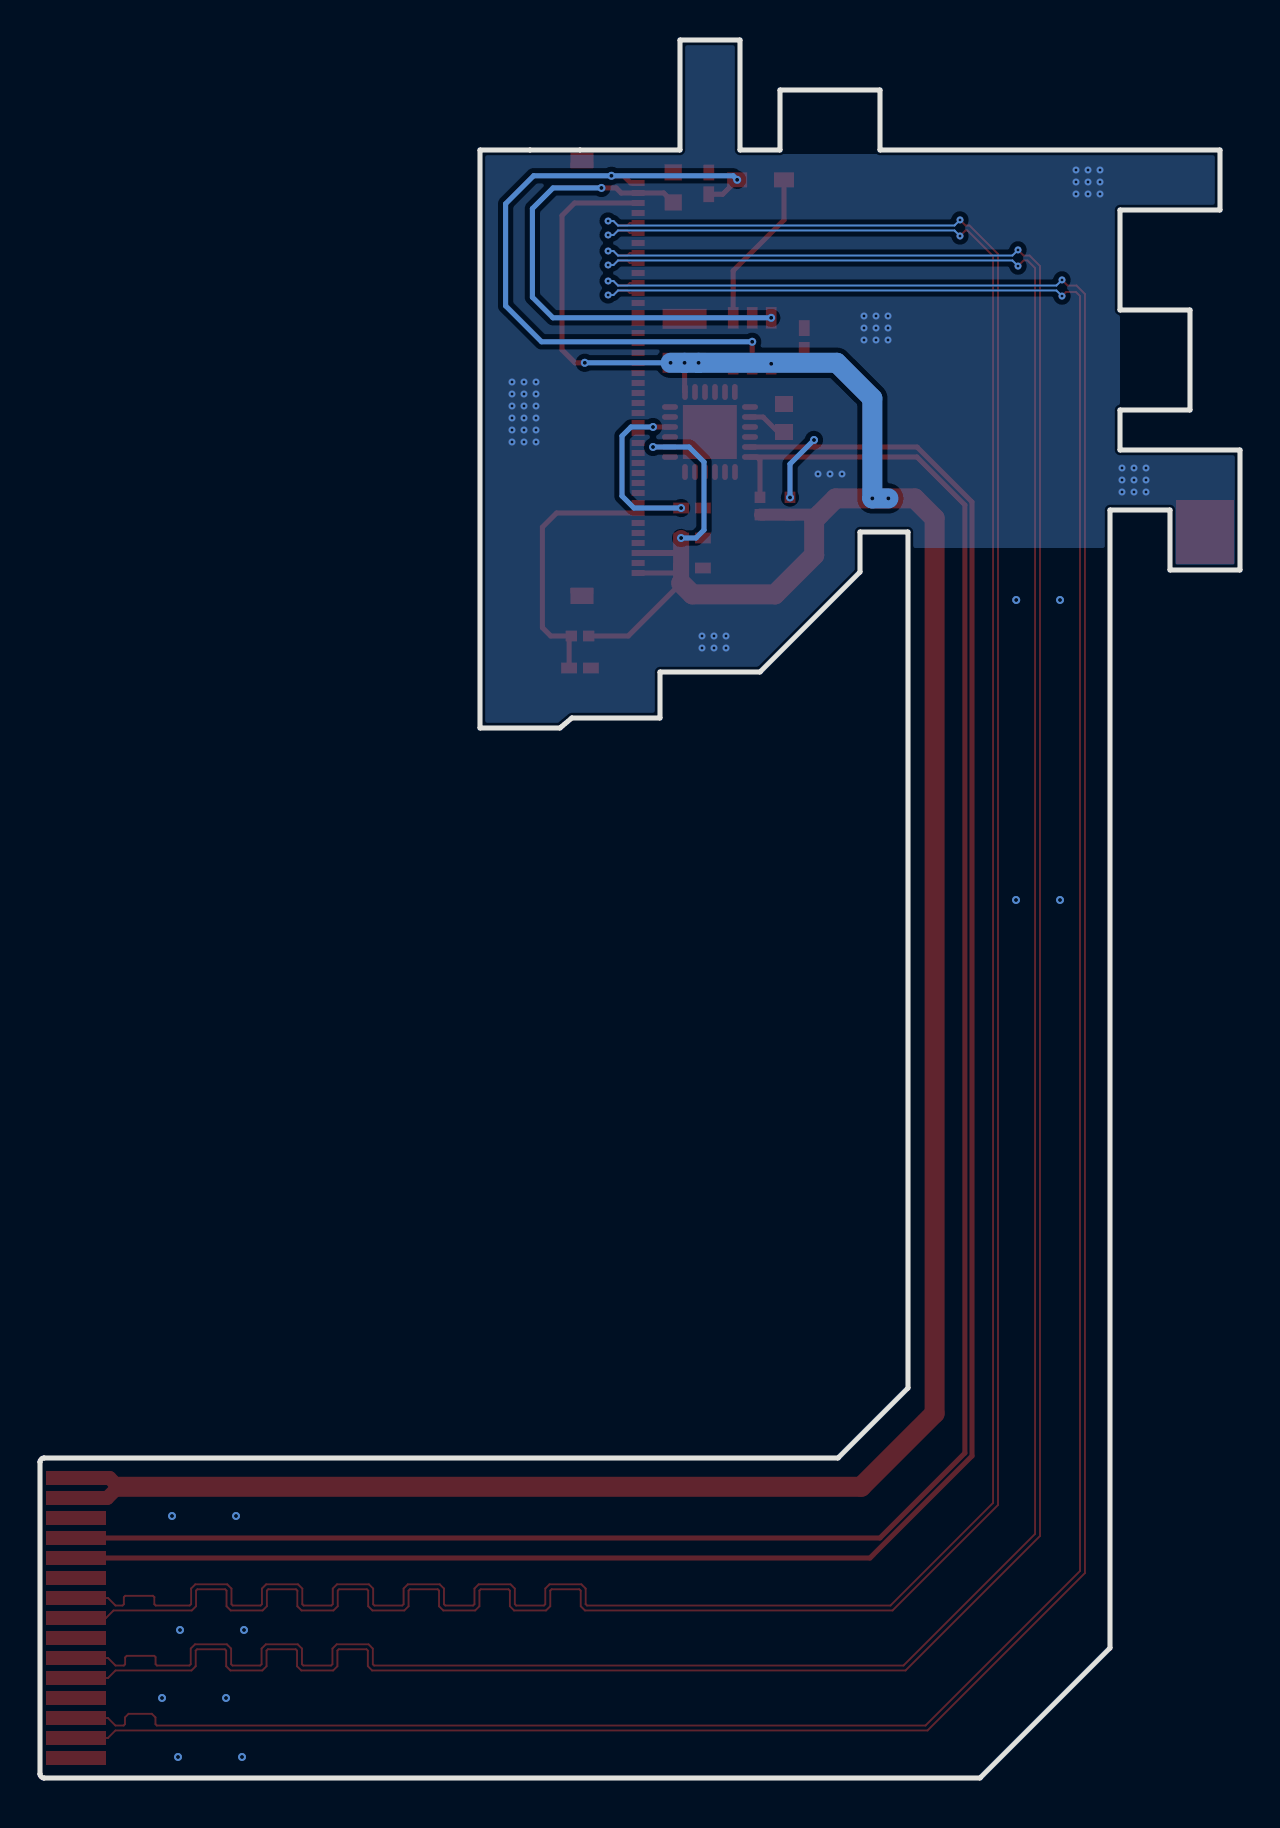
[diagram p5: board, bottom side, seen from below]

Outline 60 x 86.9 mm; copper layers: Top Layer, Bottom Layer. Coordinates in mm from the lower left corner of the outline.
Outline path: 0,66.4 0,60.4 3.5,60.4 3.5,63.4 6.5,63.4 6.5,6.5 13,0 59.8,0 arc(59.94,0.06) 60,0.2 60,15.8 arc(59.94,15.94) 59.8,16 20.1,16 16.6,19.5 16.6,62.3 19,62.3 19,60.3 24,55.3 29,55.3 29,53 33.41,53 34,52.5 38,52.5 38,81.4 28,81.4 28,86.9 25,86.9 25,81.4 23,81.4 23,84.4 18,84.4 18,81.4 1,81.4 1,78.4 6,78.4 6,73.4 2.5,73.4 2.5,68.4 6,68.4 6,66.4 0,66.4
Stack: Top Layer 0.035mm / Dielectric1 1.51mm FR4 er 4.5 / Bottom Layer 0.035mm

## Design rules (mm)
net D0P: D0
net D0N: D0
net CLKP: CLK
net CLKN: CLK
net D1P: D1
net D1N: D1
template: 自定义配置
spacing copperThickness1oz (default): track to track 0.102, other pairs 0.152 to 0.3
spacing copperThickness2oz: track to track 0.203, other pairs 0.152 to 0.3
track width copperThickness1oz (default): min 0.127, default 0.254, max 2.54
track width copperThickness2oz: min 0.203, default 0.254, max 2.54
differential pair differentialPair (default): width min 0.051, default 0.095, max 2.54; gap min 0.152, default 0.152
via viaSize (default): diameter min 0.3, default 0.4, max 10; hole min 0.1, default 0.2, max 6.3

## Placement (name value [footprint] x y rotation side)
C1  1uF  [C0402]  26.56 79.73 270 top
C2  1uF  [C0402]  21.79 71.95 90 top
C3  100nF  [C0402]  33 55.5 180 top
C4  2.2nF  [C0603]  22.8 68 270 top
C5  100nF  [C0402]  27.4 60.5 180 top
C6  100nF  [C0402]  27.4 63.5 180 top
C7  10nF  [C0402]  27.4 62 180 top
D1  B0540WS-7  [SOD-323_L1.8-W1.3-LS2.5-RD]  23.97 79.91 180 top
FPC1  HC-FPC-05-10-40RLTAG  [FPC-SMD_40P-P0.50_HCTL_HC-FPC-05-10-40RLTAG]  31.5 70 270 top
L3  22uH  [IND-SMD_L2.5-W2.0_MHCHL2520]  27.77 71.86 270 top
NOREF  -  [Pad_e3353]  58.2 7 0 top
NOREF#2  -  [Pad_e3359]  58.2 1 0 top
NOREF#3  -  [Pad_e3350]  58.2 10 0 top
NOREF#4  -  [Pad_e3355]  58.2 5 0 top
NOREF#5  -  [Pad_e62]  32.9 80.9 0 top
NOREF#6  -  [Pad_e61]  32.9 59.1 0 top
NOREF#7  -  [Pad_e3354]  58.2 6 0 top
NOREF#8  -  [Pad_e3346]  58.2 14 0 top
NOREF#9  -  [Pad_e3347]  58.2 13 0 top
NOREF#10  -  [Pad_e3345]  58.2 15 0 top
NOREF#11  -  [Pad_e3351]  58.2 9 0 top
NOREF#12  -  [Pad_e5067]  1.75 62.3 0 top
NOREF#13  -  [Pad_e3358]  58.2 2 0 top
NOREF#14  -  [Pad_e3349]  58.2 11 0 top
NOREF#15  -  [Pad_e3348]  58.2 12 0 top
NOREF#16  -  [Pad_e3357]  58.2 3 0 top
NOREF#17  -  [Pad_e3356]  58.2 4 0 top
NOREF#18  -  [Pad_e3352]  58.2 8 0 top
R1  5Ω  [R0603]  28.34 79.53 90 top
R2  10kΩ  [R0402]  33 57.1 180 top
R3  4.7kΩ  [R0402]  24 63.6 270 top
R4  4.7kΩ  [R0402]  22.5 63.6 270 top
U1  AP5724WG-7  [SOT-23-6_L2.9-W1.6-P0.95-LS2.8-BL]  24.39 71.86 180 top
U2  MPU-6050  [QFN-24_L4.0-W4.0-P0.50-BL-EP2.7]  26.5 67.3 0 top

## Footprints (pads in the part's own frame, mm; a bottom-side part is the same pattern mirrored in y, then rotated)
C0402
  rect 0.79x0.54 smd: 1(-0.545,0) 2(0.545,0)
C0603
  rect 0.8x0.9 smd: 1(-0.7,0) 2(0.7,0)
FPC-SMD_40P-P0.50_HCTL_HC-FPC-05-10-40RLTAG
  rect 0.3x0.65 smd: 1(9.75,-1.405) 2(9.25,-1.405) 3(8.75,-1.405) 4(8.25,-1.405) 5(7.75,-1.405) 6(7.25,-1.405) 7(6.75,-1.405) 8(6.25,-1.405) 9(5.75,-1.405) 10(5.25,-1.405) 11(4.75,-1.405) 12(4.25,-1.405) 13(3.75,-1.405) 14(3.25,-1.405) 15(2.75,-1.405) 16(2.25,-1.405) 17(1.75,-1.405) 18(1.25,-1.405) 19(0.75,-1.405) 20(0.25,-1.405) 21(-0.25,-1.405) 22(-0.75,-1.405) 23(-1.25,-1.405) 24(-1.75,-1.405) 25(-2.25,-1.405) 26(-2.75,-1.405) 27(-3.25,-1.405) 28(-3.75,-1.405) 29(-4.25,-1.405) 30(-4.75,-1.405) 31(-5.25,-1.405) 32(-5.75,-1.405) 33(-6.25,-1.405) 34(-6.75,-1.405) 35(-7.25,-1.405) 36(-7.75,-1.405) 37(-8.25,-1.405) 38(-8.75,-1.405) 39(-9.25,-1.405) 40(-9.75,-1.405)
  rect 0.3x1.15 smd: 41(-10.635,1.405) 42(10.635,1.405)
IND-SMD_L2.5-W2.0_MHCHL2520
  rect 1x2.2 smd: 1(-1.1,0) 2(1.1,0)
Pad_e61
  rect 1.15x0.8 smd: 1(0,0)
Pad_e62
  rect 1.15x0.8 smd: 1(0,0)
Pad_e3345
  rect 3x0.7 smd: 1(0,0)
Pad_e3346
  rect 3x0.7 smd: 2(0,0)
Pad_e3347
  rect 3x0.7 smd: 3(0,0)
Pad_e3348
  rect 3x0.7 smd: 4(0,0)
Pad_e3349
  rect 3x0.7 smd: 5(0,0)
Pad_e3350
  rect 3x0.7 smd: 6(0,0)
Pad_e3351
  rect 3x0.7 smd: 7(0,0)
Pad_e3352
  rect 3x0.7 smd: 8(0,0)
Pad_e3353
  rect 3x0.7 smd: 9(0,0)
Pad_e3354
  rect 3x0.7 smd: 10(0,0)
Pad_e3355
  rect 3x0.7 smd: 11(0,0)
Pad_e3356
  rect 3x0.7 smd: 12(0,0)
Pad_e3357
  rect 3x0.7 smd: 13(0,0)
Pad_e3358
  rect 3x0.7 smd: 14(0,0)
Pad_e3359
  rect 3x0.7 smd: 15(0,0)
Pad_e5067
  rect 2.9x3.2 smd: 1(0,0)
QFN-24_L4.0-W4.0-P0.50-BL-EP2.7
  oval 0.28x0.8 smd: 1(-1.25,-2) 2(-0.75,-2) 3(-0.25,-2) 4(0.25,-2) 5(0.75,-2) 6(1.25,-2) 13(1.25,2) 14(0.75,2) 15(0.25,2) 16(-0.25,2) 17(-0.75,2) 18(-1.242,2)
  oval 0.8x0.28 smd: 7(2,-1.25) 8(2,-0.75) 9(2,-0.25) 10(2,0.25) 11(2,0.75) 12(2,1.25) 19(-2,1.25) 20(-2,0.75) 21(-2,0.25) 22(-2,-0.25) 23(-2,-0.75) 24(-2,-1.25)
  rect 2.7x2.7 smd: 25(0.013,0)
R0402
  rect 0.566x0.54 smd: 1(-0.433,0) 2(0.433,0)
R0603
  rect 0.806x0.864 smd: 1(-0.753,0) 2(0.753,0)
SOD-323_L1.8-W1.3-LS2.5-RD
  rect 1x0.75 smd: 1(-1.173,0) 2(1.173,0)
SOT-23-6_L2.9-W1.6-P0.95-LS2.8-BL
  rect 0.532x1.072 smd: 1(-0.95,-1.149) 2(0,-1.149) 3(0.95,-1.149) 4(0.95,1.149) 5(0,1.149) 6(-0.95,1.149)

## Nets
3.3V: C2.1 C5.1 C7.1 FPC1.1 FPC1.3 FPC1.38 L3.2 NOREF#8.2 NOREF#10.1 R2.2 R3.2 R4.2 U1.4 U1.6 U2.8 U2.13
GND: C1.1 C2.2 C3.2 C4.1 C5.2 C6.2 C7.2 FPC1.2 FPC1.4 FPC1.5 FPC1.6 FPC1.8 FPC1.9 FPC1.10 FPC1.11 FPC1.12 FPC1.13 FPC1.14 FPC1.15 FPC1.16 FPC1.17 FPC1.18 FPC1.19 FPC1.20 FPC1.21 FPC1.22 FPC1.23 FPC1.24 FPC1.25 FPC1.26 FPC1.27 FPC1.28 FPC1.31 FPC1.34 FPC1.37 FPC1.41 FPC1.42 NOREF.9 NOREF#2.15 NOREF#3.6 NOREF#5.1 NOREF#6.1 NOREF#9.3 NOREF#12.1 NOREF#17.12 R1.2 U1.2 U2.1 U2.9 U2.11 U2.18 U2.25
/RESET: C3.1 FPC1.7 R2.1
CLKN: FPC1.33 NOREF#4.11
CLKP: FPC1.32 NOREF#7.10
D0N: FPC1.36 NOREF#18.8
D0P: FPC1.35 NOREF#11.7
D1N: FPC1.30 NOREF#13.14
D1P: FPC1.29 NOREF#16.13
SCL0: NOREF#14.5 R4.1 U2.23
SDA0: NOREF#15.4 R3.1 U2.24
VBL+: C1.2 D1.1 FPC1.40 U1.5
VBL-: FPC1.39 R1.1 U1.3
$1N1059: D1.2 L3.1 U1.1
$1N1429: C4.2 U2.20
$1N1625: C6.1 U2.10

Pads without a net: U2 2 3 4 5 6 7 12 14 15 16 17 19 21 22

## Via types
v1: diameter 0.4, hole 0.2, Top Layer to Bottom Layer, 30 vias
v2: diameter 0.35, hole 0.15, Top Layer to Bottom Layer, 66 vias

## Routing (per net, layer and track width the routed paths; a pad name or vN(x,y) marks a point on that pad's centre or on a via; arc(x,y) is an arc through that point)
3.3V: length 167.8
  Top Layer w0.254: C2.1 21.79,71.03 22.04,70.78 23.37,70.78 v1(23.44,70.71) ; U2.13 27.77,69.32 v1(27.77,70.76) ; R2.2 30.59,57.1 27.94,59.75 ; C5.1 28.19,60.25 FPC1.1 ; FPC1.38 33.27,78.75 33.9,78.12 33.9,71.41 33.25,70.76 v1(32.76,70.76) ; U2.8 v1(29.35,66.55)
  Top Layer w0.3: 27.94,61.28 27.98,61.25 FPC1.3
  Top Layer w0.6: 21.03,63.17 24,63.17
  Top Layer w0.7: NOREF#10.1 56.52,15 56.08,14.56 56.64,14 NOREF#8.2
  Top Layer w0.8: v1(27.94,62) C5.1 27.94,59.75
  Top Layer w1: 56.08,14.56 18.94,14.56 15.27,18.23 15.27,62.99 16.26,63.98 v1(17.58,63.98) ; 27.94,59.75 27.38,59.18 23.25,59.18 21.29,61.14 21.29,62.91 20.22,63.98 v1(18.38,63.98)
  Bottom Layer w0.254: 28.5,70.76 v1(32.76,70.76) ; v1(29.35,66.55) 27.55,66.55 26.8,65.8 26.8,62.4 27.2,62 v1(27.94,62)
  Bottom Layer w1: v1(28.47,70.76) v1(27.77,70.76) v1(27.07,70.76) 20.16,70.76 18.38,68.98 v1(18.38,63.98) v1(17.58,63.98)
GND:
  vias: v1(9,58.9) v1(9,43.9) v1(11.19,58.9) v1(11.2,43.9) v1(49.8,7.4) v1(49.9,1.05) v1(50.2,13.1) v1(50.7,4) v1(53,7.4) v1(53.1,1.05) v1(53.4,13.1) v1(53.9,4) v2(4.7,65.5) v2(4.7,64.9) v2(4.7,64.3) v2(5.3,65.5) v2(5.3,64.9) v2(5.3,64.3) v2(5.9,65.5) v2(5.9,64.9) v2(5.9,64.3) v2(7,80.4) v2(7,79.8) v2(7,79.2) v2(7.6,80.4) v2(7.6,79.8) v2(7.6,79.2) v2(8.2,80.4) v2(8.2,79.8) v2(8.2,79.2) v2(17.6,73.1) v2(17.6,72.5) v2(17.6,71.9) v2(18.2,73.1) v2(18.2,72.5) v2(18.2,71.9) v2(18.8,73.1) v2(18.8,72.5) v2(18.8,71.9) v2(19.9,65.2) v2(20.5,65.2) v2(21.1,65.2) v2(25.7,57.1) v2(25.7,56.5) v2(26.3,57.1) v2(26.3,56.5) v2(26.9,57.1) v2(26.9,56.5) v2(35.2,69.8) v2(35.2,69.2) v2(35.2,68.6) v2(35.2,68) v2(35.2,67.4) v2(35.2,66.8) v2(35.8,69.8) v2(35.8,69.2) v2(35.8,68.6) v2(35.8,68) v2(35.8,67.4) v2(35.8,66.8) v2(36.4,69.8) v2(36.4,69.2) v2(36.4,68.6) v2(36.4,68) v2(36.4,67.4) v2(36.4,66.8)
/RESET: length 13.4
  Top Layer w0.254: FPC1.7 34.17,63.25 34.88,62.54 34.88,57.52 34.46,57.1 R2.1 33.54,56.99 C3.1
CLKN: length 143.8
  Top Layer w0.095: v2(31.59,76.35) 31.32,76.35 31.1,76.12 30.64,76.12 30.51,76.25 FPC1.33 ; NOREF#4.11 56.6,5 56.22,5.38 52.43,5.38 52.22,5.59 52.22,6.37 52.15,6.44 50.76,6.44 50.69,6.37 50.69,5.59 50.48,5.38 48.88,5.38 48.67,5.59 48.67,6.37 48.61,6.44 47.22,6.44 47.15,6.37 47.15,5.59 46.94,5.38 45.34,5.38 45.13,5.59 45.13,6.37 45.06,6.44 43.67,6.44 43.61,6.37 43.61,5.59 43.4,5.38 16.72,5.38 10,12.1 10,75.6 10.52,76.12 10.82,76.12 v2(11.1,76.4)
  Bottom Layer w0.095: v2(11.1,76.4) 11.38,76.12 31.1,76.12 31.32,76.35 v2(31.59,76.35)
CLKP: length 143.8
  Top Layer w0.095: NOREF#7.10 56.6,6 56.22,5.62 55.81,5.62 55.75,5.69 55.75,6.03 55.66,6.11 54.29,6.11 54.22,6.04 54.22,5.69 54.15,5.62 52.53,5.62 52.46,5.69 52.46,6.47 52.25,6.68 50.66,6.68 50.44,6.47 50.44,5.69 50.38,5.62 48.99,5.62 48.92,5.69 48.92,6.47 48.71,6.68 47.11,6.68 46.9,6.47 46.9,5.69 46.83,5.62 45.44,5.62 45.38,5.69 45.38,6.47 45.17,6.68 43.57,6.68 43.36,6.47 43.36,5.69 43.29,5.62 16.83,5.62 10.25,12.2 10.25,75.5 10.63,75.88 10.82,75.88 v2(11.1,75.6) ; v2(31.59,75.65) 31.32,75.65 31.1,75.88 30.64,75.88 30.51,75.75 FPC1.32
  Bottom Layer w0.095: v2(31.59,75.65) 31.32,75.65 31.1,75.88 11.38,75.88 v2(11.1,75.6)
D0N: length 143.8
  Top Layer w0.095: FPC1.36 30.51,77.75 30.64,77.62 31.1,77.62 31.32,77.85 v2(31.59,77.85) ; v2(14,77.9) 13.72,77.62 13.52,77.62 12.1,76.2 12.1,13.65 17.37,8.38 32.75,8.38 32.96,8.59 32.96,9.37 33.03,9.44 34.42,9.44 34.49,9.37 34.49,8.59 34.7,8.38 36.29,8.38 36.51,8.59 36.51,9.37 36.57,9.44 37.96,9.44 38.03,9.37 38.03,8.59 38.24,8.38 39.84,8.38 40.05,8.59 40.05,9.37 40.12,9.44 41.5,9.44 41.57,9.37 41.57,8.59 41.78,8.38 43.38,8.38 43.59,8.59 43.59,9.37 43.66,9.44 45.05,9.44 45.11,9.37 45.11,8.59 45.33,8.38 46.92,8.38 47.13,8.59 47.13,9.37 47.2,9.44 48.59,9.44 48.66,9.37 48.66,8.59 48.87,8.38 50.46,8.38 50.67,8.59 50.67,9.37 50.74,9.44 52.13,9.44 52.2,9.37 52.2,8.59 52.41,8.38 56.32,8.38 56.7,8 NOREF#18.8
  Bottom Layer w0.095: v2(14,77.9) 14,77.9 14.28,77.62 31.1,77.62 31.32,77.85 v2(31.59,77.85)
D0P: length 143.8
  Top Layer w0.095: v2(14,77.1) 13.72,77.38 13.63,77.38 12.35,76.1 12.35,13.75 17.48,8.62 32.65,8.62 32.72,8.69 32.72,9.47 32.93,9.68 34.52,9.68 34.74,9.47 34.74,8.69 34.8,8.62 36.19,8.62 36.26,8.69 36.26,9.47 36.47,9.68 38.07,9.68 38.28,9.47 38.28,8.69 38.34,8.62 39.73,8.62 39.8,8.69 39.8,9.47 40.01,9.68 41.61,9.68 41.82,9.47 41.82,8.69 41.89,8.62 43.28,8.62 43.34,8.69 43.34,9.47 43.56,9.68 45.15,9.68 45.36,9.47 45.36,8.69 45.43,8.62 46.82,8.62 46.88,8.69 46.88,9.47 47.1,9.68 48.69,9.68 48.9,9.47 48.9,8.69 48.97,8.62 50.36,8.62 50.43,8.69 50.43,9.47 50.64,9.68 52.23,9.68 52.44,9.47 52.44,8.69 52.51,8.62 54.22,8.62 54.28,8.69 54.28,9.04 54.35,9.11 55.74,9.11 55.81,9.04 55.81,8.69 55.87,8.62 56.22,8.62 56.6,9 NOREF#11.7 ; v2(31.59,77.15) 31.32,77.15 31.1,77.38 30.64,77.38 30.51,77.25 FPC1.35
  Bottom Layer w0.095: v2(14,77.1) 14.28,77.38 31.1,77.38 31.32,77.15 v2(31.59,77.15)
D1N: length 143.8
  Top Layer w0.095: NOREF#13.14 56.6,2 56.23,2.38 15.62,2.38 7.75,10.25 7.75,74.2 8.17,74.62 8.62,74.62 v2(8.9,74.9) ; v2(31.59,74.85) 31.32,74.85 31.1,74.62 30.64,74.62 30.51,74.75 FPC1.30
  Bottom Layer w0.095: v2(8.9,74.9) 9.18,74.62 31.1,74.62 31.32,74.85 v2(31.59,74.85)
D1P: length 143.8
  Top Layer w0.095: FPC1.29 30.51,74.25 30.64,74.38 31.1,74.38 31.32,74.15 v2(31.59,74.15) ; v2(8.9,74.1) 8.7,74.3 8.2,74.3 8,74.1 8,10.35 15.73,2.62 54.16,2.62 54.23,2.69 54.23,3.03 54.41,3.21 55.57,3.21 55.75,3.03 55.75,2.69 55.82,2.62 56.23,2.62 56.6,3 NOREF#16.13
  Bottom Layer w0.095: v2(31.59,74.15) 31.32,74.15 31.1,74.38 9.18,74.38 v2(8.9,74.1)
SCL0: length 110.6
  Top Layer w0.254: v1(21.3,66.9) 21.3,66.57 21.28,66.55 ; 21.28,66.55 16.15,66.55 13.4,63.8 13.4,16.1 18.5,11 NOREF#14.5 ; 21.28,66.55 U2.23
  Bottom Layer w0.254: v1(22.5,64.03) 22.5,65.7 v1(21.3,66.9)
SDA0: length 107.4
  Top Layer w0.254: R3.1 24,65.9 24.15,66.05 ; 24.15,66.05 16.15,66.05 13.76,63.65 13.76,16.25 18,12 NOREF#15.4 ; 24.15,66.05 U2.24
VBL+: length 34.7
  Top Layer w0.254: C1.2 25.87,79.19 v1(25.14,79.91) ; FPC1.40 30.46,79.75 30.82,80.11 v1(31.43,80.11) ; U1.5 v1(24.39,71.81)
  Bottom Layer w0.254: v1(24.39,71.81) 34.92,71.81 36.72,73.61 36.72,78.71 35.32,80.11 v1(31.43,80.11) 25.34,80.11 v1(25.14,79.91)
VBL-: length 24.6
  Top Layer w0.254: v1(31.93,79.5) 31.19,79.5 30.94,79.25 FPC1.39 28.81,79.25 R1.1
  Bottom Layer w0.254: v1(31.93,79.5) 34.35,79.5 35.38,78.47 35.38,74.04 34.35,73.01 v1(23.44,73.01)
$1N1059: length 8
  Top Layer w0.254: D1.2 22.8,77.9 25.34,75.36 U1.1
$1N1429: length 2
  Top Layer w0.254: C4.2 23.1,67.3 23.85,68.05 U2.20
$1N1625: length 8.8
  Top Layer w0.254: U2.10 v1(29.35,67.55)
  Bottom Layer w0.254: v1(27.94,63.5) 30.3,63.5 30.9,64.1 30.9,67.1 30.45,67.55 v1(29.35,67.55)

## Copper pours and planes (outline as drawn; the poured copper is in the pictures)
3.3V on Top Layer: 25.08,71.27 28.87,71.27 28.87,70.18 25.08,70.18
GND on Top Layer: 16.6,61.5 6.5,61.5 6.5,63.4 0,63.4 0,66.4 6,66.4 6,78.4 1,78.4 1,81.2 24.8,81.2 25,81.4 25,86.9 28,86.9 28,81.4 38,81.4 38,52.5 33.91,52.5 33.41,53 29,53 29,55.3 24,55.3 19,60.3 19,62.3 16.6,62.3
GND on Top Layer: 6.5,6.5 6.5,62.3 16.6,62.3 16.6,19.5 20.1,16 60,16 60,0 13,0
GND on Bottom Layer: 6.5,6.5 6.5,62.3 16.6,62.3 16.6,19.5 20.1,16 60,16 60,0 13,0
GND on Bottom Layer: 16.6,61.5 6.5,61.5 6.5,63.4 3.5,63.4 3.5,60.4 0,60.4 0,66.4 6,66.4 6,78.4 1,78.4 1,81.2 24.8,81.2 25,81.4 25,86.9 28,86.9 28,81.4 38,81.4 38,52.5 33.91,52.5 33.41,53 29,53 29,55.3 24,55.3 19,60.3 19,62.3 16.6,62.3
$1N1059 on Top Layer: 25.08,73.54 28.87,73.54 28.87,72.46 25.08,72.46

## Text on the board
Top Silkscreen Layer: 40 | 1 | 15
